# EAGLE design marty (EAGLE 6.4)

## Sheet 1 of 3: Logic
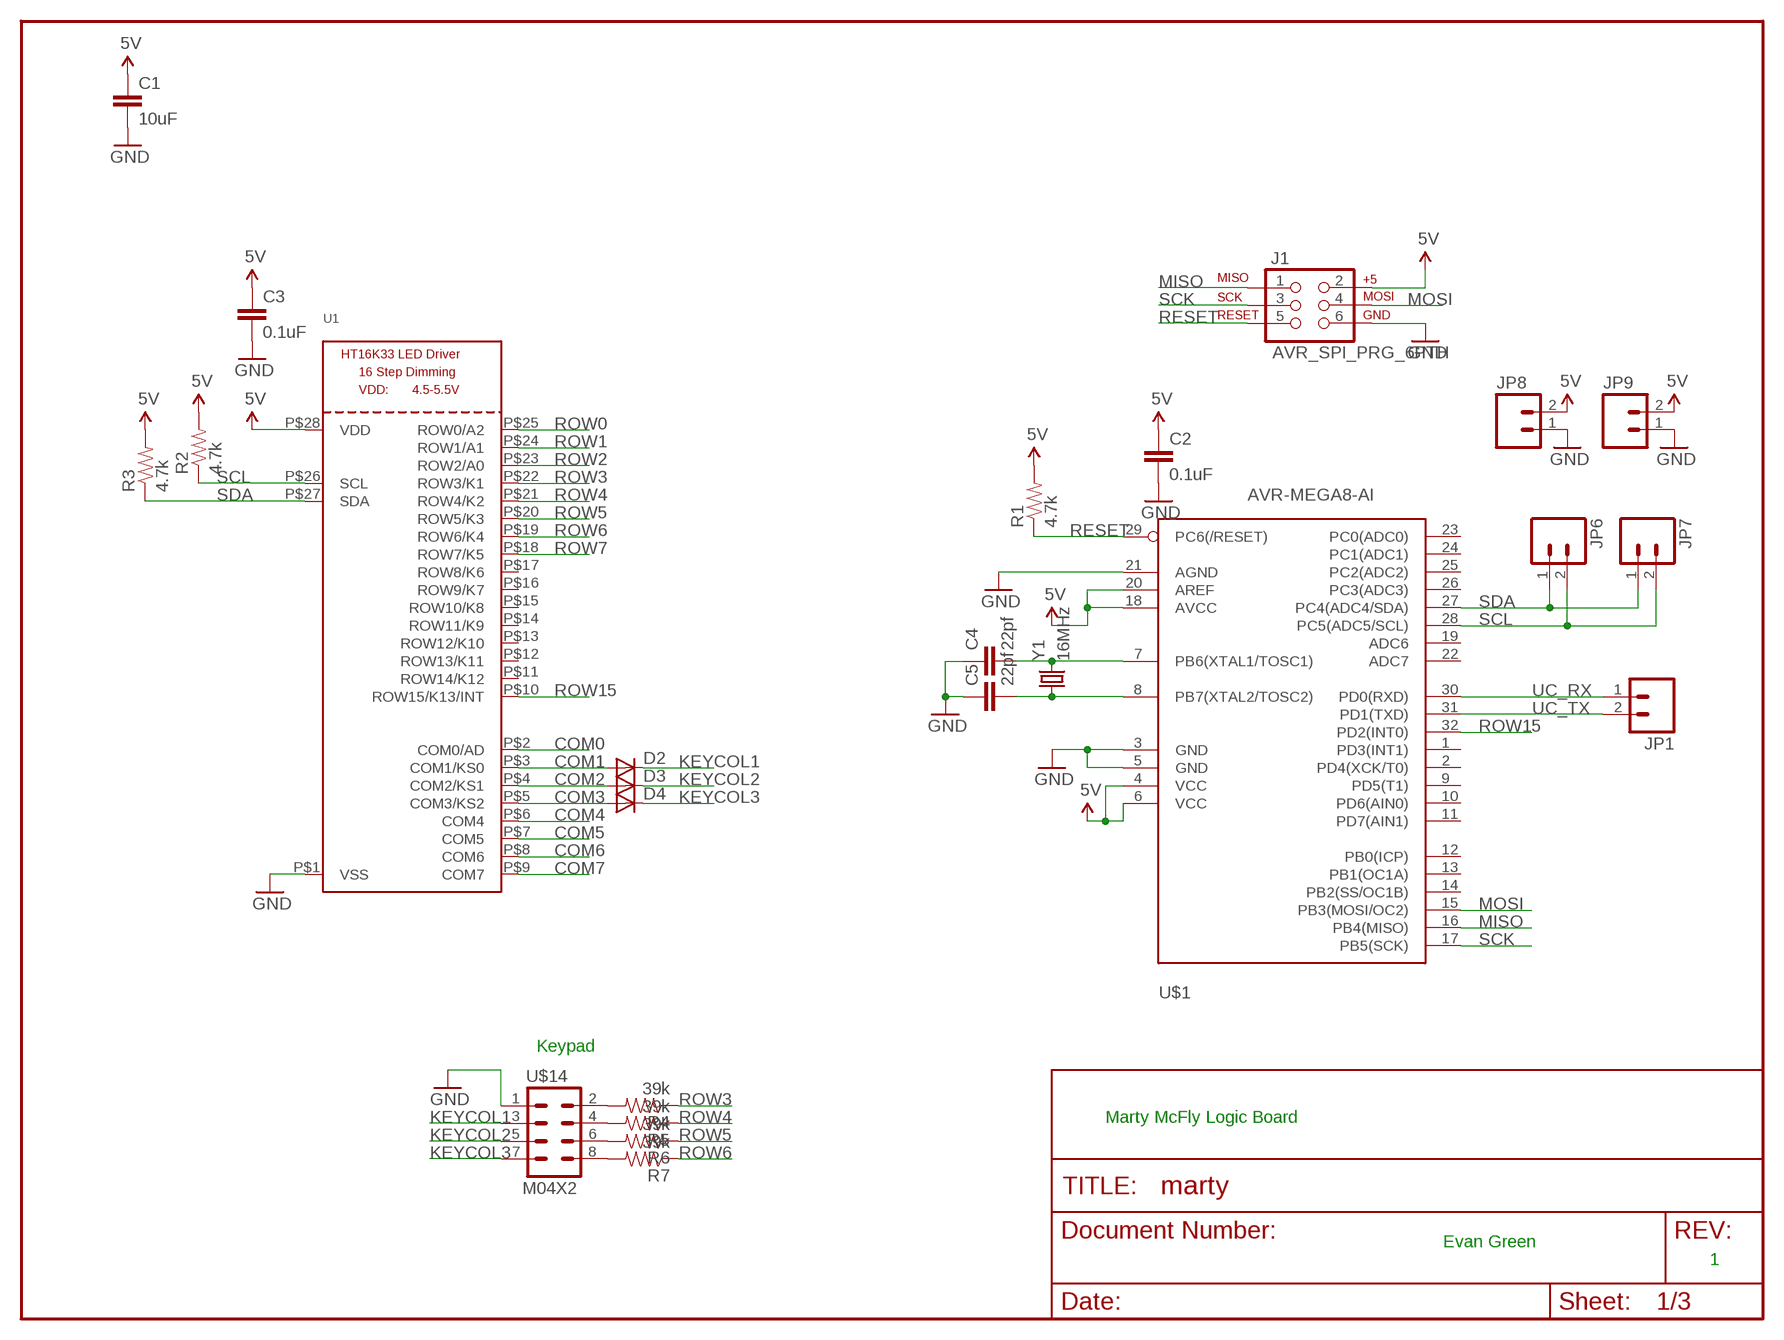
[diagram p0: schematic, sheet 1]

### Parts
C1  10uF  CAP1210  [1210]
C2  0.1uF  CAP0402-CAP  [0402-CAP]
C3  0.1uF  CAP0402-CAP  [0402-CAP]
C4  22pf  CAP0402-CAP  [0402-CAP]
C5  22pf  CAP0402-CAP  [0402-CAP]
D2  DIODESOD  [SOD-323]
D3  DIODESOD  [SOD-323]
D4  DIODESOD  [SOD-323]
J1  AVR_SPI_PRG_6PTH  [2X3]
JP1  M02PTH  [1X02]
JP6  M02PTH  [1X02]
JP7  M02PTH  [1X02]
JP8  M02PTH  [1X02]
JP9  M02PTH  [1X02]
R1  4.7k  RESISTOR0402-RES  [0402-RES]
R2  4.7k  RESISTOR0402-RES  [0402-RES]
R3  4.7k  RESISTOR0402-RES  [0402-RES]
R4  39k  RESISTOR0402-RES  [0402-RES]
R5  39k  RESISTOR0402-RES  [0402-RES]
R6  39k  RESISTOR0402-RES  [0402-RES]
R7  39k  RESISTOR0402-RES  [0402-RES]
U1  HT16K33_SOP28  [SOP28_300MIL]
U$1  AVR-MEGA8-AI  [TQFP32-08]
U$14  M04X2  [2X4]
Y1  16MHz  CRYSTALHC49US  [HC49US]

### Nets
5V: C1.1 C2.1 C3.1 J1.2 JP8.2 JP9.2 R1.2 R2.2 R3.2 U1.P$28(VDD) U$1.4(VCC) U$1.6(VCC) U$1.18(AVCC) U$1.20(AREF)
COM0: U1.P$2(COM0/AD) ; also sheet 3
COM1: D2.2(A) U1.P$3(COM1/KS0) ; also sheet 3
COM2: D3.2(A) U1.P$4(COM2/KS1) ; also sheet 3
COM3: D4.2(A) U1.P$5(COM3/KS2) ; also sheet 3
COM4: U1.P$6(COM4) ; also sheet 3
COM5: U1.P$7(COM5) ; also sheet 3
COM6: U1.P$8(COM6) ; also sheet 3
COM7: U1.P$9(COM7) ; also sheet 3
GND: C1.2 C2.2 C3.2 C4.1 C5.1 J1.6 JP8.1 JP9.1 U1.P$1(VSS) U$1.3(GND) U$1.5(GND) U$1.21(AGND) U$14.1
KEYCOL1: D2.1(C) U$14.3
KEYCOL2: D3.1(C) U$14.5
KEYCOL3: D4.1(C) U$14.7
MISO: J1.1 U$1.16(PB4(MISO))
MOSI: J1.4 U$1.15(PB3(MOSI/OC2))
N$1: C4.2 U$1.7(PB6(XTAL1/TOSC1)) Y1.2
N$2: C5.2 U$1.8(PB7(XTAL2/TOSC2)) Y1.1
N$3: R4.2 U$14.2
N$4: R5.2 U$14.4
N$5: R6.2 U$14.6
N$6: R7.2 U$14.8
RESET: J1.5 R1.1 U$1.29(PC6(/RESET))
ROW0: U1.P$25(ROW0/A2) ; also sheet 3
ROW1: U1.P$24(ROW1/A1) ; also sheet 3
ROW2: U1.P$23(ROW2/A0) ; also sheet 3
ROW3: R4.1 U1.P$22(ROW3/K1) ; also sheet 3
ROW4: R5.1 U1.P$21(ROW4/K2) ; also sheet 3
ROW5: R6.1 U1.P$20(ROW5/K3) ; also sheet 3
ROW6: R7.1 U1.P$19(ROW6/K4) ; also sheet 3
ROW7: U1.P$18(ROW7/K5) ; also sheet 3
ROW15: U1.P$10(ROW15/K13/INT) U$1.32(PD2(INT0))
SCK: J1.3 U$1.17(PB5(SCK))
SCL: JP6.2 JP7.2 R2.1 U1.P$26(SCL) U$1.28(PC5(ADC5/SCL))
SDA: JP6.1 JP7.1 R3.1 U1.P$27(SDA) U$1.27(PC4(ADC4/SDA))
UC_RX: JP1.1 U$1.30(PD0(RXD))
UC_TX: JP1.2 U$1.31(PD1(TXD))
Unconnected: U1.P$11(ROW14/K12) U1.P$12(ROW13/K11) U1.P$13(ROW12/K10) U1.P$14(ROW11/K9) U1.P$15(ROW10/K8) U1.P$16(ROW9/K7) U1.P$17(ROW8/K6) U$1.1(PD3(INT1)) U$1.2(PD4(XCK/T0)) U$1.9(PD5(T1)) U$1.10(PD6(AIN0)) U$1.11(PD7(AIN1)) U$1.12(PB0(ICP)) U$1.13(PB1(OC1A)) U$1.14(PB2(SS/OC1B)) U$1.19(ADC6) U$1.22(ADC7) U$1.23(PC0(ADC0)) U$1.24(PC1(ADC1)) U$1.25(PC2(ADC2)) U$1.26(PC3(ADC3))

### Notes on the sheet
- Keypad
- Marty McFly Logic Board
- Evan Green
- 1

## Sheet 2 of 3: LEDs
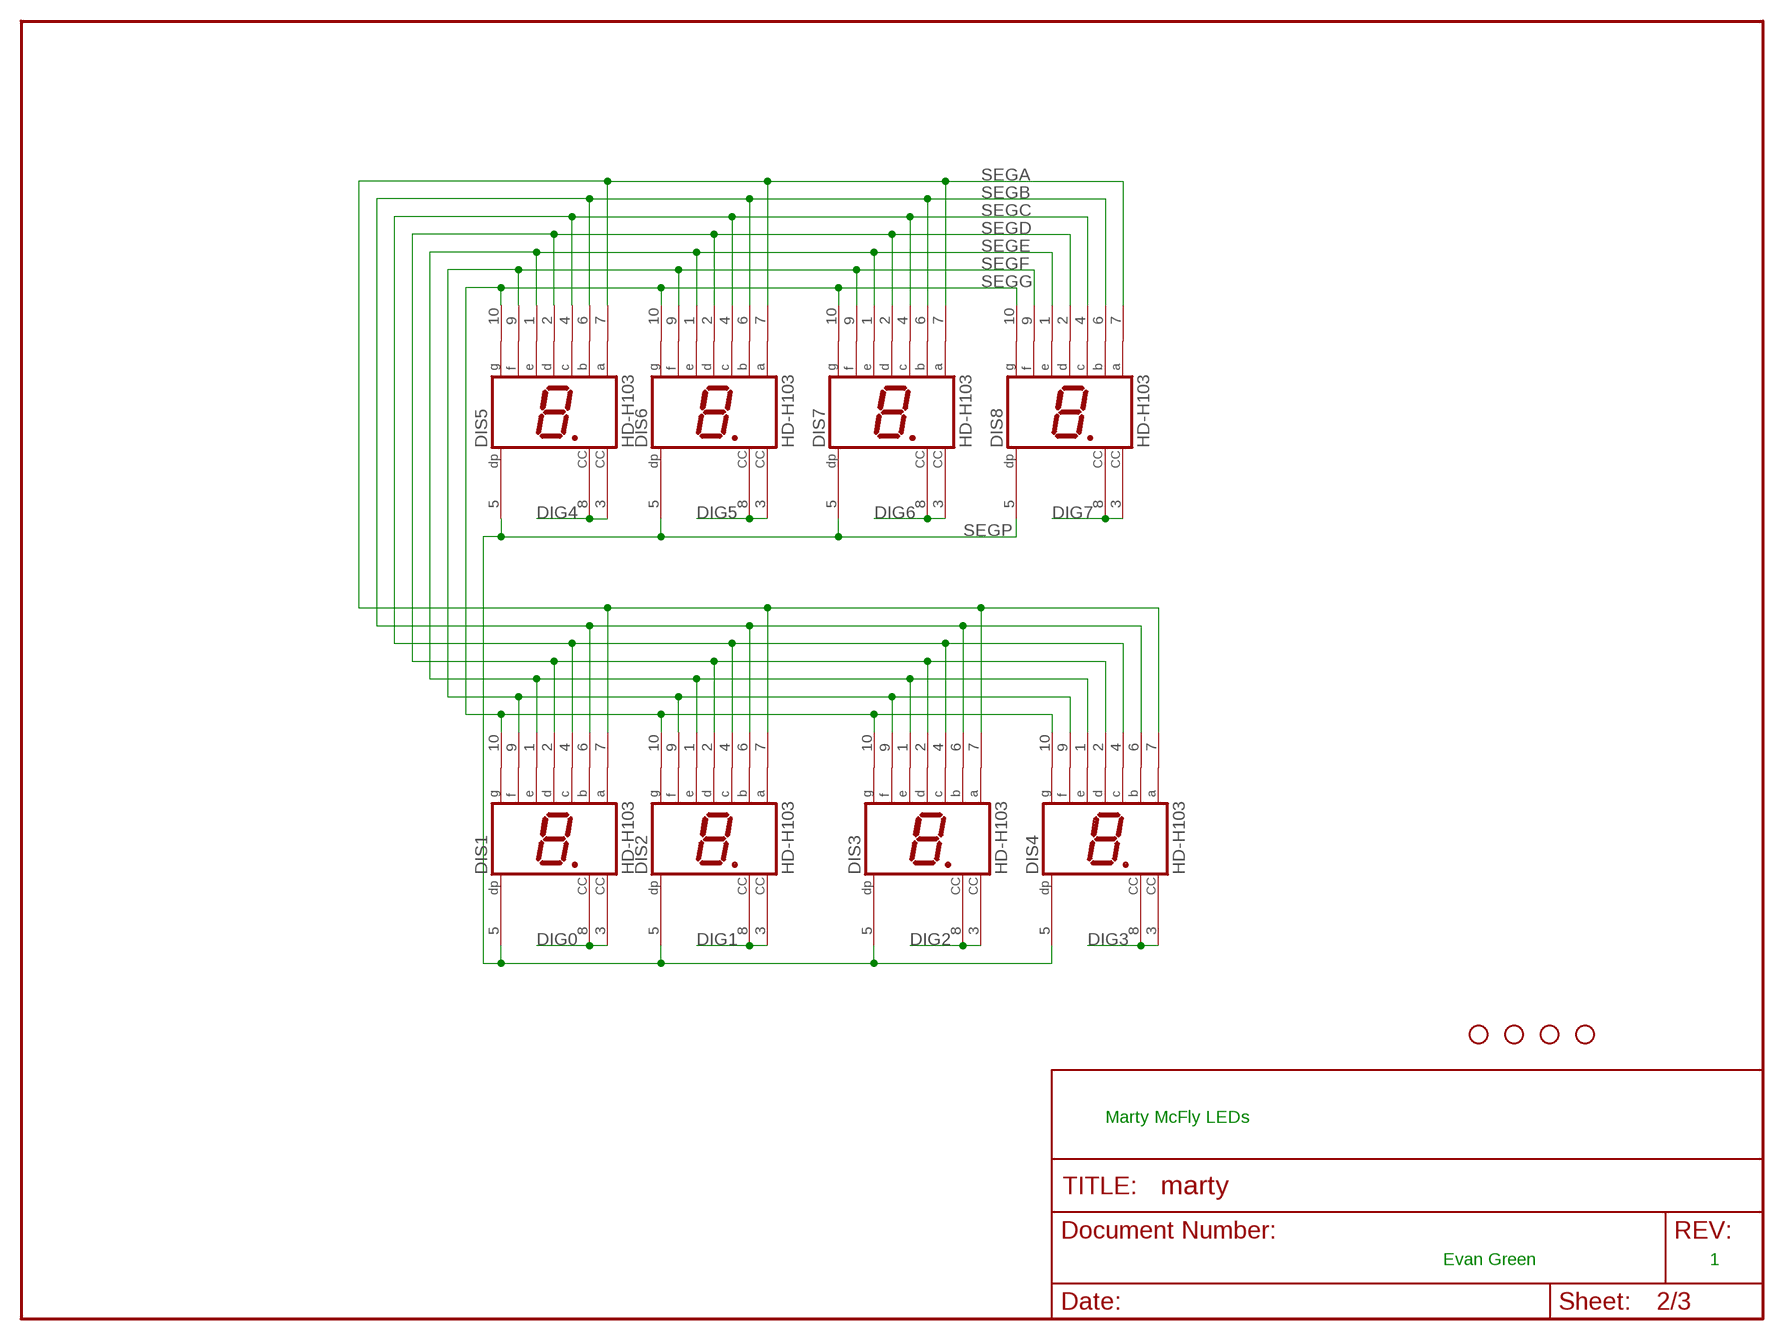
[diagram p1: schematic, sheet 2]

### Parts
DIS1  HD-H103  [HDSP-M]
DIS2  HD-H103  [HDSP-M]
DIS3  HD-H103  [HDSP-M]
DIS4  HD-H103  [HDSP-M]
DIS5  HD-H103  [HDSP-M]
DIS6  HD-H103  [HDSP-M]
DIS7  HD-H103  [HDSP-M]
DIS8  HD-H103  [HDSP-M]
JP2  STAND-OFF  [STAND-OFF]
JP3  STAND-OFF  [STAND-OFF]
JP4  STAND-OFF  [STAND-OFF]
JP5  STAND-OFF  [STAND-OFF]

### Nets
DIG0: DIS1.3(CC) DIS1.8(CC) ; also sheet 3
DIG1: DIS2.3(CC) DIS2.8(CC) ; also sheet 3
DIG2: DIS3.3(CC) DIS3.8(CC) ; also sheet 3
DIG3: DIS4.3(CC) DIS4.8(CC) ; also sheet 3
DIG4: DIS5.3(CC) DIS5.8(CC) ; also sheet 3
DIG5: DIS6.3(CC) DIS6.8(CC) ; also sheet 3
DIG6: DIS7.3(CC) DIS7.8(CC) ; also sheet 3
DIG7: DIS8.3(CC) DIS8.8(CC) ; also sheet 3
SEGA: DIS1.7(A) DIS2.7(A) DIS3.7(A) DIS4.7(A) DIS5.7(A) DIS6.7(A) DIS7.7(A) DIS8.7(A) ; also sheet 3
SEGB: DIS1.6(B) DIS2.6(B) DIS3.6(B) DIS4.6(B) DIS5.6(B) DIS6.6(B) DIS7.6(B) DIS8.6(B) ; also sheet 3
SEGC: DIS1.4(C) DIS2.4(C) DIS3.4(C) DIS4.4(C) DIS5.4(C) DIS6.4(C) DIS7.4(C) DIS8.4(C) ; also sheet 3
SEGD: DIS1.2(D) DIS2.2(D) DIS3.2(D) DIS4.2(D) DIS5.2(D) DIS6.2(D) DIS7.2(D) DIS8.2(D) ; also sheet 3
SEGE: DIS1.1(E) DIS2.1(E) DIS3.1(E) DIS4.1(E) DIS5.1(E) DIS6.1(E) DIS7.1(E) DIS8.1(E) ; also sheet 3
SEGF: DIS1.9(F) DIS2.9(F) DIS3.9(F) DIS4.9(F) DIS5.9(F) DIS6.9(F) DIS7.9(F) DIS8.9(F) ; also sheet 3
SEGG: DIS1.10(G) DIS2.10(G) DIS3.10(G) DIS4.10(G) DIS5.10(G) DIS6.10(G) DIS7.10(G) DIS8.10(G) ; also sheet 3
SEGP: DIS1.5(DP) DIS2.5(DP) DIS3.5(DP) DIS4.5(DP) DIS5.5(DP) DIS6.5(DP) DIS7.5(DP) DIS8.5(DP) ; also sheet 3

### Notes on the sheet
- Marty McFly LEDs
- Evan Green | 1

## Sheet 3 of 3: Mux
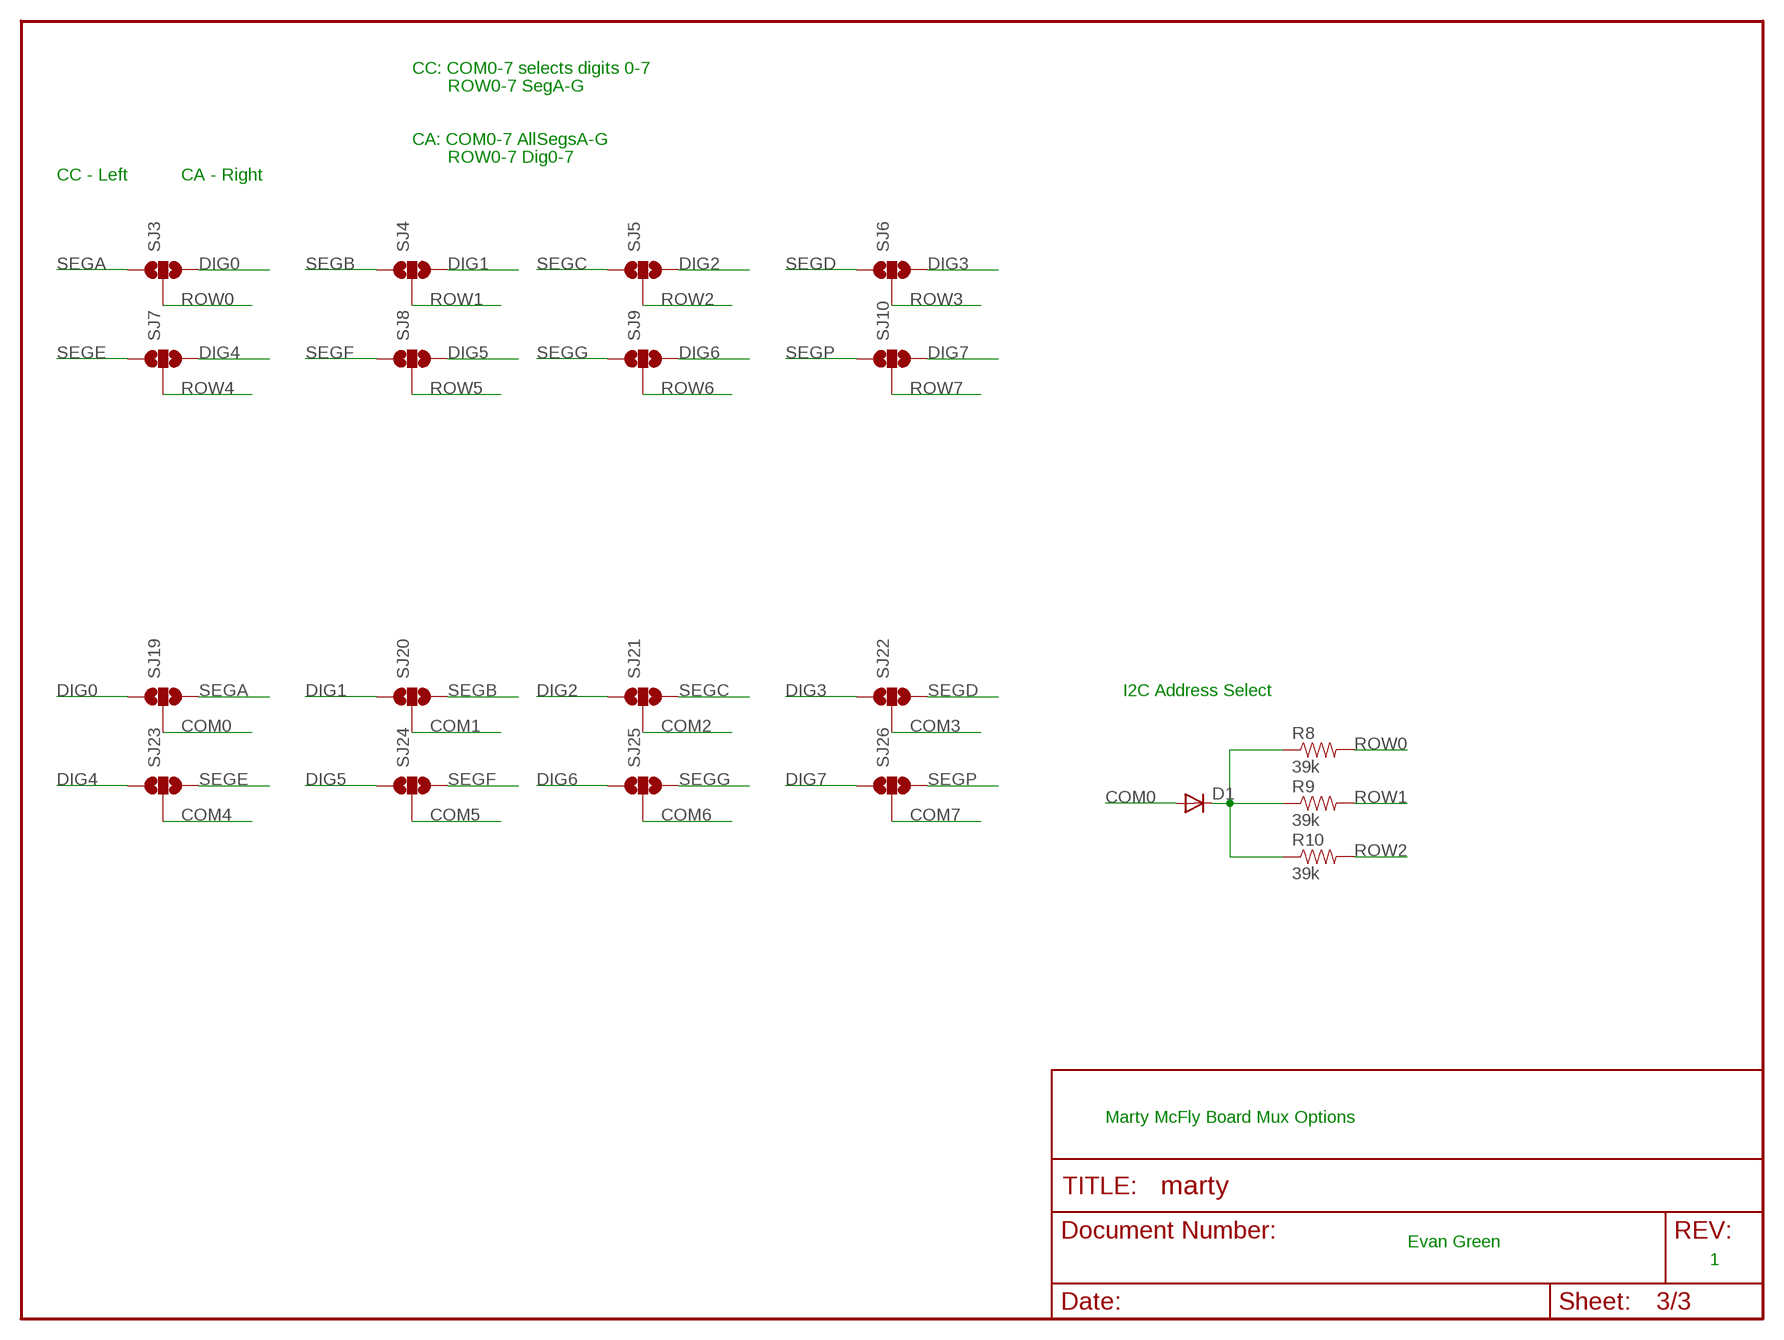
[diagram p2: schematic, sheet 3]

### Parts
D1  DIODESOD  [SOD-323]
R8  39k  RESISTOR0402-RES  [0402-RES]
R9  39k  RESISTOR0402-RES  [0402-RES]
R10  39k  RESISTOR0402-RES  [0402-RES]
SJ3  SOLDERJUMPER_2WAYS  [SJ_3]
SJ4  SOLDERJUMPER_2WAYS  [SJ_3]
SJ5  SOLDERJUMPER_2WAYS  [SJ_3]
SJ6  SOLDERJUMPER_2WAYS  [SJ_3]
SJ7  SOLDERJUMPER_2WAYS  [SJ_3]
SJ8  SOLDERJUMPER_2WAYS  [SJ_3]
SJ9  SOLDERJUMPER_2WAYS  [SJ_3]
SJ10  SOLDERJUMPER_2WAYS  [SJ_3]
SJ19  SOLDERJUMPER_2WAYS  [SJ_3]
SJ20  SOLDERJUMPER_2WAYS  [SJ_3]
SJ21  SOLDERJUMPER_2WAYS  [SJ_3]
SJ22  SOLDERJUMPER_2WAYS  [SJ_3]
SJ23  SOLDERJUMPER_2WAYS  [SJ_3]
SJ24  SOLDERJUMPER_2WAYS  [SJ_3]
SJ25  SOLDERJUMPER_2WAYS  [SJ_3]
SJ26  SOLDERJUMPER_2WAYS  [SJ_3]

### Nets
COM0: D1.2(A) SJ19.2 ; also sheet 1
COM1: SJ20.2 ; also sheet 1
COM2: SJ21.2 ; also sheet 1
COM3: SJ22.2 ; also sheet 1
COM4: SJ23.2 ; also sheet 1
COM5: SJ24.2 ; also sheet 1
COM6: SJ25.2 ; also sheet 1
COM7: SJ26.2 ; also sheet 1
DIG0: SJ3.3 SJ19.1 ; also sheet 2
DIG1: SJ4.3 SJ20.1 ; also sheet 2
DIG2: SJ5.3 SJ21.1 ; also sheet 2
DIG3: SJ6.3 SJ22.1 ; also sheet 2
DIG4: SJ7.3 SJ23.1 ; also sheet 2
DIG5: SJ8.3 SJ24.1 ; also sheet 2
DIG6: SJ9.3 SJ25.1 ; also sheet 2
DIG7: SJ10.3 SJ26.1 ; also sheet 2
N$8: D1.1(C) R8.1 R9.1 R10.1
ROW0: R8.2 SJ3.2 ; also sheet 1
ROW1: R9.2 SJ4.2 ; also sheet 1
ROW2: R10.2 SJ5.2 ; also sheet 1
ROW3: SJ6.2 ; also sheet 1
ROW4: SJ7.2 ; also sheet 1
ROW5: SJ8.2 ; also sheet 1
ROW6: SJ9.2 ; also sheet 1
ROW7: SJ10.2 ; also sheet 1
SEGA: SJ3.1 SJ19.3 ; also sheet 2
SEGB: SJ4.1 SJ20.3 ; also sheet 2
SEGC: SJ5.1 SJ21.3 ; also sheet 2
SEGD: SJ6.1 SJ22.3 ; also sheet 2
SEGE: SJ7.1 SJ23.3 ; also sheet 2
SEGF: SJ8.1 SJ24.3 ; also sheet 2
SEGG: SJ9.1 SJ25.3 ; also sheet 2
SEGP: SJ10.1 SJ26.3 ; also sheet 2

### Notes on the sheet
- CC: COM0-7 selects digits 0-7
- ROW0-7 SegA-G
- CA: COM0-7 AllSegsA-G
- ROW0-7 Dig0-7
- CC - Left | CA - Right
- I2C Address Select
- Marty McFly Board Mux Options
- Evan Green
- 1

## Library data of the parts
C1-C5 = SparkFun:CAP: Capacitor Standard 0603 ceramic capacitor, and 0.1" leaded capacitor.
D1-D4 = SparkFun:DIODE: Diode These are standard reverse protection diodes and small signal diodes. SMA package can handle up to about 1A. SOD-323 can handle about 200mA. What the SOD-323 package when ordering, there are some mfgs out there that are 5-pin packages.
DIS1-DIS8 = display-hp:HD-H103: LED DISPLAY 1-character 7 segment, decimal point right
J1 = SparkFun:AVR_SPI_PRG_6: AVR ISP 6 Pin This is the reduced ISP connector for AVR programming. Common on Arduino. This footprint will take up less PCB space and can be used with a 10-pin to 6-pin adapter such as SKU: BOB-08508
JP1 JP6-JP9 = SparkFun:M02: Header 2 Standard 2-pin 0.1" header. Use with straight break away headers (SKU : PRT-00116), right angle break away headers (PRT-00553), swiss pins (PRT-00743), machine pins (PRT-00117), and female headers (PRT-00115). Molex polarized connector foot print use with SKU : PRT-08233 with associated crimp pins and housings.
JP2-JP5 = SparkFun:STAND-OFF: Stand Off This is the mechanical footprint for a #4 phillips button head screw. Use the keepout ring to avoid running the screw head into surrounding components. SKU : PRT-00447
R1-R10 = SparkFun:RESISTOR: Resistor Basic schematic elements and footprints for 0603, 1206, and PTH resistors.
SJ3-SJ10 SJ19-SJ26 = SparkFun:SOLDERJUMPER_2WAY: Solder Jumper 2 way solder jumper
U1 = microbuilder:HT16K33_SOP28
U$1 = SparkFun:AVR-MEGA8: MICROCONTROLLER 8 Kbytes FLASH 1 kbytes SRAM 512 bytes EEPROM USART 6-channel 10 bit ADC 2-channel 8 bit ADC
U$14 = SparkFun:M04X2
Y1 = SparkFun:CRYSTAL: Crystals Various standard crystals. Proven footprints. Spark Fun Electronics SKU : COM-00534

## Board
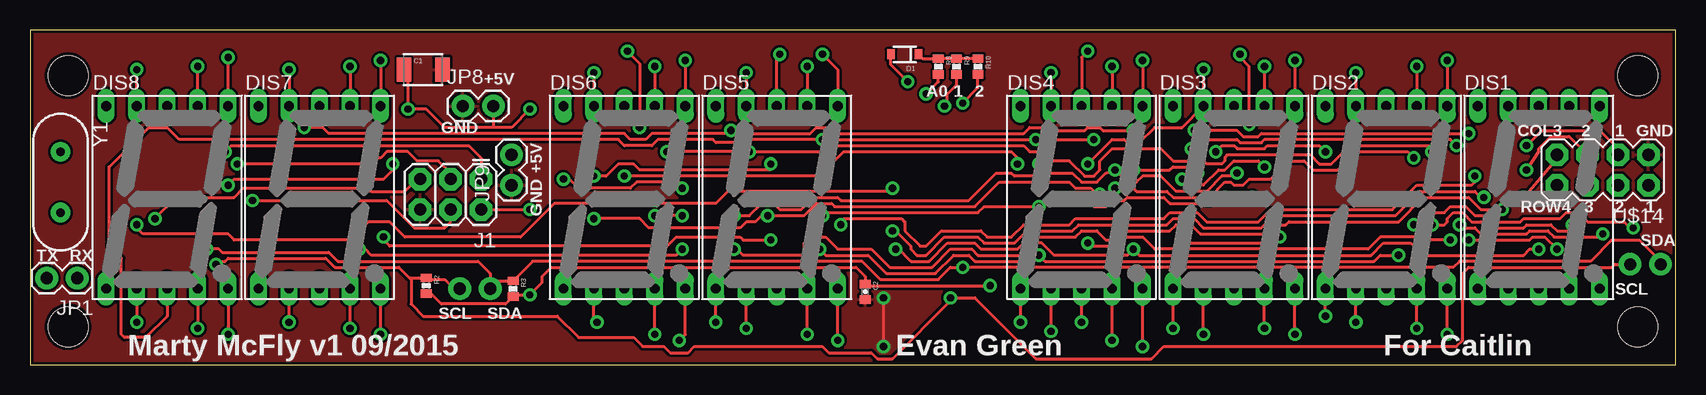
[diagram p3: board, top side]
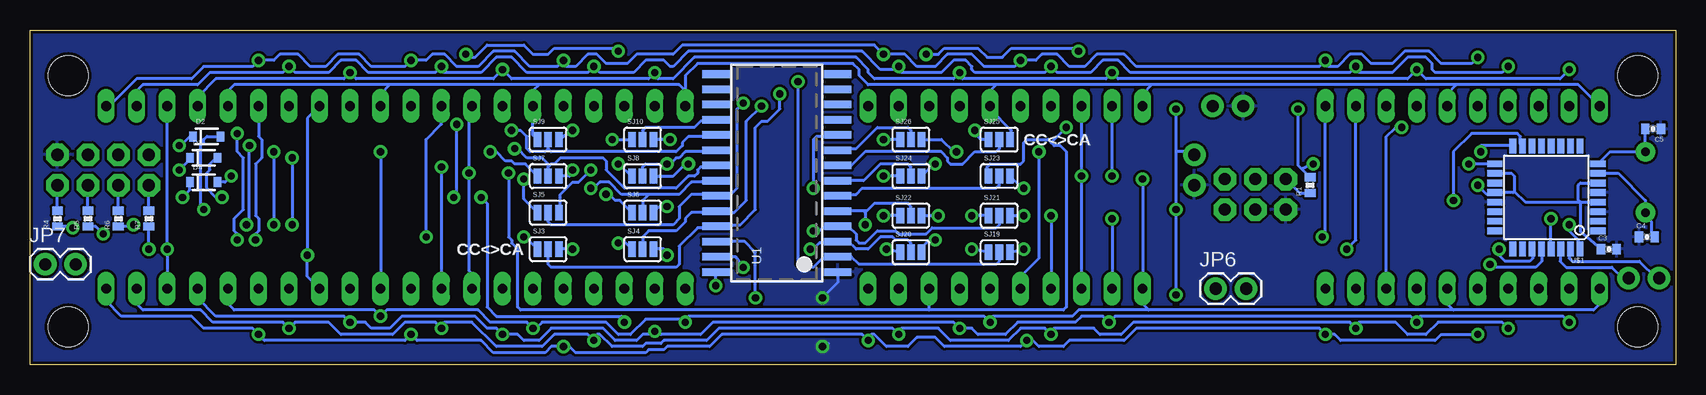
[diagram p4: board, bottom side, seen from below]

Size 137.16 x 27.94 mm. Coordinates in mm from the lower left corner, seen from the top.
Outline: 0,0 137.16,0 137.16,27.94 0,27.94 0,0
Copper layers (1*16): Top 0.035mm / dielectric 1.5mm / Bottom 0.035mm
Design rules "SparkFun": minimum track width 8mil, minimum drill 20mil, track to track 8mil, track to pad 8mil, pad to pad 8mil, via to via 8mil, smd to smd 8mil, copper to edge 10mil, drill to drill 8mil, minimum pad ring 12mil, minimum via ring 10mil, stop-mask expansion 4mil, vias tented up to drill 25mil, thermal gap 10mil

### Footprints (pad centres in the part's own frame; a part is rotated, then mirrored left to right if it is on the bottom)
1210 = smd 1.2 x 2: 1 -1.6,0; 2 1.6,0
0402-CAP = smd 0.7 x 0.9: 1 -0.65,0; 2 0.65,0
SOD-323 = smd 0.63 x 0.83: 1 -1.15,0; 2 1.15,0
HDSP-M = drill 0.813 long: 1 -5.08,-7.62; 2 -2.54,-7.62; 3 0,-7.62; 4 2.54,-7.62; 5 5.08,-7.62; 6 5.08,7.62; 7 2.54,7.62; 8 0,7.62; 9 -2.54,7.62; 10 -5.08,7.62
2X3 = drill 1.016 pad 1.88 octagon: 1 0,0; 2 0,2.54; 3 2.54,0; 4 2.54,2.54; 5 5.08,0; 6 5.08,2.54
1X02 = drill 1.016 pad 1.88: 1 0,0; 2 2.54,0
STAND-OFF = hole 3.302: 0,0
0402-RES = smd 0.7 x 0.9: 1 -0.65,0; 2 0.65,0
SJ_3 = smd 0.635 x 1.27: 1 -0.889,0; 2 0,0; 3 0.889,0
SOP28_300MIL = smd 0.635 x 2.286: P$1 -8.255,-5.08; P$2 -6.985,-5.08; P$3 -5.715,-5.08; P$4 -4.445,-5.08; P$5 -3.175,-5.08; P$6 -1.905,-5.08; P$7 -0.635,-5.08; P$8 0.635,-5.08; P$9 1.905,-5.08; P$10 3.175,-5.08; P$11 4.445,-5.08; P$12 5.715,-5.08; P$13 6.985,-5.08; P$14 8.255,-5.08; P$15 8.255,5.08; P$16 6.985,5.08; P$17 5.715,5.08; P$18 4.445,5.08; P$19 3.175,5.08; P$20 1.905,5.08; P$21 0.635,5.08; P$22 -0.635,5.08; P$23 -1.905,5.08; P$24 -3.175,5.08; P$25 -4.445,5.08; P$26 -5.715,5.08; P$27 -6.985,5.08; P$28 -8.255,5.08
TQFP32-08 = smd 1.27 x 0.559: 1 -4.293,2.8; 2 -4.293,2; 3 -4.293,1.2; 4 -4.293,0.4; 5 -4.293,-0.4; 6 -4.293,-1.2; 7 -4.293,-2; 8 -4.293,-2.8; 17 4.293,-2.8; 18 4.293,-2; 19 4.293,-1.2; 20 4.293,-0.4; 21 4.293,0.4; 22 4.293,1.2; 23 4.293,2; 24 4.293,2.8 | smd 0.559 x 1.27: 9 -2.8,-4.293; 10 -2,-4.293; 11 -1.2,-4.293; 12 -0.4,-4.293; 13 0.4,-4.293; 14 1.2,-4.293; 15 2,-4.293; 16 2.8,-4.293; 25 2.8,4.293; 26 2,4.293; 27 1.2,4.293; 28 0.4,4.293; 29 -0.4,4.293; 30 -1.2,4.293; 31 -2,4.293; 32 -2.8,4.293
2X4 = drill 1.016 pad 1.88 octagon: 1 -3.81,-1.27; 2 -3.81,1.27; 3 -1.27,-1.27; 4 -1.27,1.27; 5 1.27,-1.27; 6 1.27,1.27; 7 3.81,-1.27; 8 3.81,1.27
HC49US = drill 0.7 pad 1.651: 1 -2.54,0; 2 2.54,0

### Placement (x,y rotation side)
C1  32.77,24.64 0 top
C2  69.6,6.1 270 top
C3  5.59,9.65 0 bottom
C4  2.41,10.67 0 bottom
C5  1.91,19.68 180 bottom
D1  72.9,25.91 180 top
D2  122.43,19.05 0 bottom
D3  122.68,17.27 0 bottom
D4  122.68,15.24 0 bottom
DIS1  125.73,13.97 0 top
DIS2  113.03,13.97 0 top
DIS3  100.33,13.97 0 top
DIS4  87.63,13.97 0 top
DIS5  62.23,13.97 0 top
DIS6  49.53,13.97 0 top
DIS7  24.13,13.97 0 top
DIS8  11.43,13.97 0 top
J1  37.59,15.49 180 top
JP1  3.94,7.24 180 top
JP2  3.17,24.13 0 top
JP3  3.17,3.17 0 top
JP4  133.99,3.17 0 top
JP5  133.99,24.13 0 top
JP6  38.35,6.35 0 bottom
JP7  135.89,8.38 0 bottom
JP8  36.07,21.59 0 top
JP9  40.13,14.99 90 top
R1  30.48,14.99 90 bottom
R2  33.02,6.6 270 top
R3  40.26,6.35 270 top
R4  134.87,12.19 90 bottom
R5  132.33,12.19 90 bottom
R6  129.79,12.19 90 bottom
R7  127.25,12.19 90 bottom
R8  75.69,24.89 270 top
R9  77.22,24.89 270 top
R10  78.99,24.89 270 top
SJ3  93.98,9.65 0 bottom
SJ4  86.11,9.65 0 bottom
SJ5  93.98,12.7 0 bottom
SJ6  86.11,12.7 0 bottom
SJ7  93.98,15.75 0 bottom
SJ8  86.11,15.75 0 bottom
SJ9  93.98,18.8 0 bottom
SJ10  86.11,18.8 0 bottom
SJ19  56.39,9.4 0 bottom
SJ20  63.75,9.4 0 bottom
SJ21  56.39,12.45 0 bottom
SJ22  63.75,12.45 0 bottom
SJ23  56.39,15.75 0 bottom
SJ24  63.75,15.75 0 bottom
SJ25  56.39,18.8 0 bottom
SJ26  63.75,18.8 0 bottom
U1  74.93,16 90 bottom
U$1  10.79,13.97 180 bottom
U$14  131.06,16.26 180 top
Y1  2.54,15.24 270 top

### Tracks (layer width: path | path; a pad name or v marks a point on that pad's centre or on a via)
5V  (via drill 0.6)
  Top 0.254: v16.51,14.99 17.02,15.49 29.46,15.49 30.48,16.51 v30.23,16.76 | R2.2 33.42,5.95 34.29,5.08 39.64,5.08 R3.2 40.4,5.84 v41.66,5.84 42.67,6.86 42.67,7.37 43.43,8.13 68.83,8.13 69.6,7.37 C2.1 69.74,6.6 v80.01,6.6 | v41.66,21.34 40.13,19.81 38.61,19.81 | 38.61,19.81 34.54,19.81 33.02,21.34 v31.5,21.34 31.5,24.31 C1.1 | J1.2 v41.66,12.95 | JP8.2 38.61,19.81
  Bottom 0.254: U$1.18 15.06,16 13.72,16 13.46,15.75 13.46,14.48 | 13.46,14.48 13.57,14.37 U$1.20 15.23,14.22 15.75,14.22 v16.51,14.99 | 13.46,14.48 12.55,13.57 7.95,13.57 | 7.95,13.57 U$1.4 | 7.95,13.57 8.13,13.75 8.13,14.99 7.94,15.17 U$1.6 | C3.1 7.95,11.11 7.95,13.57 | v31.5,21.34 31.5,16.65 31.17,16.33 | v41.66,5.84 v41.66,12.95 41.66,17.78 | 41.66,17.78 v41.66,21.34 | v80.01,6.6 U1.P$28 | R1.2 31.17,16.33 | v30.23,16.76 31.17,16.33 | JP9.2 40.39,17.78 41.66,17.78
COM0  (via drill 0.6)
  Top 0.254: v73.15,23.62 71.75,25.03 D1.2
  Bottom 0.254: SJ19.2 56.39,8.64 56.64,8.38 68.07,8.38 68.71,9.02 U1.P$2 69.98,8.89 71.12,8.89 71.88,8.13 72.9,8.13 73.15,8.38 v73.15,23.62
COM1  (via drill 0.6)
  Top 0.254: v122.68,12.95 120.9,12.95 119.89,13.97 116.08,13.97 114.05,11.94 104.9,11.94 104.65,11.68 103.63,11.68 102.87,10.92 97.54,10.92 96.77,11.68 95.5,11.68 95,11.18 90.93,11.18 90.17,10.41 89.66,10.41 88.9,11.18 87.63,11.18 87.12,10.67 83.31,10.67 82.3,9.65 79.25,9.65 78.74,10.16 76.45,10.16 74.93,8.64 73.41,8.64 72.39,9.65 v72.14,9.65
  Bottom 0.254: SJ20.2 63.75,10.16 64.01,10.41 65.02,10.41 65.28,10.67 66.29,10.67 67.31,9.65 68.33,9.65 68.96,10.29 U1.P$3 69.98,10.16 71.37,10.16 71.88,9.65 v72.14,9.65 | D2.2 122.43,19.05 122.68,18.8 122.68,18.54 122.94,18.29 122.94,13.21 v122.68,12.95
COM2  (via drill 0.6)
  Top 0.254: v121.16,13.97 120.9,13.97 120.4,14.48 115.82,14.48 113.79,12.45 103.63,12.45 102.62,11.43 97.79,11.43 97.03,12.19 95.25,12.19 94.74,11.68 87.38,11.68 86.87,11.18 83.06,11.18 82.04,10.16 79.5,10.16 78.99,10.67 76.2,10.67 74.68,9.14 73.91,9.14 73.41,9.65 73.41,9.91 72.14,11.18 v71.88,11.18
  Bottom 0.254: SJ21.2 56.39,11.68 56.64,11.43 61.98,11.43 62.48,10.92 64.77,10.92 65.02,11.18 66.55,11.18 67.56,10.16 68.07,10.16 68.33,10.41 68.33,10.92 68.96,11.56 U1.P$4 69.98,11.43 71.12,11.43 71.37,11.18 v71.88,11.18 | v121.16,13.97 121.67,13.97 122.43,14.73 122.43,16 122.17,16.26 122.17,16.76 121.67,17.27 D3.2
COM3  (via drill 0.6)
  Top 0.254: v67.56,11.68 67.82,12.19 72.64,12.19 72.9,11.94 72.9,11.18 74.17,9.91 74.68,9.91 75.95,11.18 79.25,11.18 79.76,10.67 81.79,10.67 82.8,11.68 86.61,11.68 87.12,12.19 94.49,12.19 95,12.7 97.28,12.7 98.04,11.94 102.36,11.94 103.38,12.95 113.54,12.95 115.57,14.99 120.14,14.99 120.4,15.24 v120.4,15.75
  Bottom 0.254: SJ22.2 63.75,13.21 64.01,13.46 66.8,13.46 67.44,12.83 | 67.44,12.83 U1.P$5 | 67.44,12.83 67.56,12.7 v67.56,11.68 | v120.4,15.75 120.9,15.24 D4.2
COM4
  Bottom 0.254: U1.P$6 69.72,14.22 68.33,14.22 67.82,14.73 56.64,14.73 56.39,14.99 SJ23.2
COM5
  Bottom 0.254: SJ24.2 63.75,16.51 64.01,16.76 66.29,16.76 67.69,15.37 U1.P$7
COM6
  Bottom 0.254: SJ25.2 56.39,18.03 56.64,17.78 58.42,17.78 59.44,16.76 60.45,16.76 60.71,17.02 60.71,17.27 61.21,17.78 67.56,17.78 68.71,16.64 U1.P$8
COM7
  Bottom 0.254: U1.P$9 69.72,18.03 68.33,18.03 66.55,19.81 64.01,19.81 63.75,19.56 SJ26.2
DIG0  (via drill 0.6)
  Top 0.254: v58.67,9.65 58.93,9.65 59.44,9.14 64.26,9.14 64.52,9.4 64.52,10.16 65.02,10.67 66.29,10.67 67.31,9.65 70.1,9.65 71.63,8.13 75.18,8.13 76.71,9.65 78.49,9.65 78.99,9.14 82.55,9.14 83.57,10.16 84.33,10.16 85.34,9.14 91.44,9.14 v91.95,9.65 92.46,9.14 111.76,9.14 112.78,10.16 115.06,10.16 116.08,9.14 124.46,9.14 124.97,9.65 v125.73,9.65
  Bottom 0.254: SJ19.1 v58.67,9.65 | v91.95,9.65 SJ3.3 | DIS1.3 v125.73,9.65 DIS1.8
DIG1  (via drill 0.6)
  Top 0.254: v114.05,9.14 112.52,9.14 112.01,8.64 84.58,8.64 v84.07,9.14 83.31,9.14 82.8,8.64 78.74,8.64 78.23,9.14 76.96,9.14 75.44,7.62 71.37,7.62 69.85,9.14 66.29,9.14 v65.79,9.65
  Bottom 0.254: SJ20.1 v65.79,9.65 | v84.07,9.14 84.33,9.65 SJ4.3 | 113.03,5.84 DIS2.3 114.05,7.37 v114.05,9.14 114.05,20.57 DIS2.8
DIG2  (via drill 0.6)
  Top 0.254: v58.67,12.45 59.94,12.45 60.96,13.46 61.98,13.46 62.48,12.95 64.26,12.95 65.28,13.97 67.31,13.97 67.56,13.72 78.23,13.72 80.52,16 81.79,16 82.04,15.75 84.58,15.75 84.84,16 86.87,16 87.63,15.24 88.9,15.24 89.66,16 v90.42,16.26 91.44,15.24 92.2,15.24 92.71,15.75 94.23,15.75 95.5,14.48 98.04,14.48 99.31,15.75 100.33,15.75 v100.58,16
  Bottom 0.254: SJ21.1 v58.67,12.45 | DIS3.8 100.58,21.34 v100.58,16 100.58,7.87 100.33,7.62 DIS3.3 | SJ5.3 92.96,12.83 92.96,14.22 91.95,15.24 91.44,15.24 v90.42,16.26
DIG3  (via drill 0.6)
  Top 0.254: v66.04,12.45 66.29,12.7 78.99,12.7 79.5,13.21 v84.07,13.21 84.84,13.97 87.88,13.97 88.65,13.21 89.66,13.21 90.17,13.72 91.19,13.72 91.44,13.97 94.49,13.97 95,13.46 98.55,13.46 99.06,13.97 v99.57,13.97 v101.85,13.97 | v87.63,3.56 DIS4.3 | v100.84,25.91 100.84,25.65 101.6,24.89 v101.6,20.07 | v88.14,26.16 87.63,25.65 DIS4.8
  Bottom 0.254: SJ22.1 v66.04,12.45 | v87.63,3.56 87.63,3.81 87.88,4.06 98.3,4.06 99.06,4.83 99.06,13.46 v99.57,13.97 | v100.84,25.91 100.58,25.65 100.08,25.65 99.06,26.67 96.01,26.67 95.25,25.91 93.98,25.91 93.47,26.42 88.39,26.42 v88.14,26.16 | SJ6.3 84.71,13.21 v84.07,13.21 | v101.85,13.97 101.6,14.22 v101.6,20.07
DIG4  (via drill 0.6)
  Top 0.254: DIS5.8 62.23,25.65 v62.48,25.91 | v49.78,26.16 50.8,25.15 v50.8,19.81 | v91.95,16.26 95,16.26 95.25,16.51 96.52,16.51 97.03,16 v97.28,16
  Bottom 0.254: SJ23.1 57.4,15.88 57.4,16.51 57.15,16.76 54.61,16.76 54.36,17.02 54.36,18.54 54.1,18.8 52.32,18.8 52.07,18.54 | 52.07,18.54 51.82,18.29 51.31,18.29 50.8,17.78 50.8,4.83 51.05,4.57 62.23,4.57 | v62.48,25.91 61.47,25.91 60.96,26.42 58.17,26.42 57.4,25.65 56.13,25.65 55.37,26.42 49.78,26.42 v49.78,26.16 | v50.8,19.81 52.07,18.54 | 62.23,4.57 DIS5.3 | 62.23,4.57 96.27,4.57 96.52,4.83 96.52,9.65 97.03,10.16 97.03,10.41 97.28,10.67 v97.28,16 | v91.95,16.26 92.2,15.75 SJ7.3
DIG5  (via drill 0.6)
  Top 0.254: v49.53,15.75 v66.04,15.75 66.04,16 67.82,17.78 81.79,17.78 82.3,17.27 v82.3,16.76
  Bottom 0.254: SJ24.1 v66.04,15.75 | DIS6.8 v49.53,15.75 DIS6.3 | SJ8.3 83.57,15.75 82.55,16.76 v82.3,16.76
DIG6  (via drill 0.6)
  Top 0.254: 24.13,19.81 DIS7.8 | 24.13,19.81 24.38,19.81 24.89,19.3 49.53,19.3 50.04,18.8 51.31,18.8 51.82,19.3 58.17,19.3 v58.42,19.56 58.67,19.3 65.02,19.3 65.53,19.81 66.55,19.81 67.06,19.3 82.8,19.3 83.31,19.81 84.58,19.81 84.84,19.56 87.88,19.56 88.14,19.81 89.15,19.81 89.41,19.56 v91.95,19.56 | 24.13,19.81 v22.86,19.81
  Bottom 0.254: SJ25.1 57.91,18.8 58.42,19.3 v58.42,19.56 | v91.95,19.56 SJ9.3 | DIS7.3 24.13,19.05 23.37,19.81 v22.86,19.81
DIG7  (via drill 0.6)
  Top 0.254: v83.82,18.8 v66.04,18.8 59.18,18.8 58.93,18.54 57.15,18.54 56.9,18.8 52.32,18.8 51.82,18.29 49.53,18.29 49.02,18.8 12.45,18.8 11.43,19.81 | 11.43,19.81 DIS8.8 | DIS8.3 11.43,4.06 9.65,2.29 7.87,2.29 7.62,2.54 7.62,8.89 6.6,9.91 6.6,16.51 9.91,19.81 11.43,19.81
  Bottom 0.254: SJ26.1 v66.04,18.8 | v83.82,18.8 SJ10.3
GND  (via drill 0.6)
  Top 0.254: v71.12,5.59 v71.12,1.52
  Bottom 0.254: U1.P$1 69.85,6.86 v71.12,5.59 | v71.12,1.52 70.61,1.78
  pour Top: 0,0 137.16,0 137.16,27.94 0,27.94
  pour Bottom: 0,0 137.16,0 137.16,27.94 0,27.94
KEYCOL1  (via drill 0.6)
  Top 0.254: v124.71,18.29 125.98,19.56 130.81,19.56 132.33,18.03 U$14.3
  Bottom 0.254: v124.71,18.29 124.59,18.29 123.83,19.05 D2.1
KEYCOL2  (via drill 0.6)
  Top 0.254: v124.71,16.26 125.73,17.78 125.73,18.03 126.75,19.05 128.27,19.05 U$14.5
  Bottom 0.254: v124.71,16.26 123.83,17.14 D3.1
KEYCOL3  (via drill 0.6)
  Top 0.254: v124.46,13.97 127.25,17.27 U$14.7
  Bottom 0.254: v124.46,13.97 123.83,14.6 D4.1
MISO  (via drill 0.6)
  Top 0.254: v16.26,17.78 16.76,18.29 36.58,18.29 37.59,17.27 J1.1
  Bottom 0.254: U$1.16 13.62,18.29 16.26,18.29 v16.26,17.78
MOSI  (via drill 0.6)
  Top 0.254: v18.54,13.72 29.72,13.72 32,11.43 34.54,11.43 35.05,11.94 J1.4
  Bottom 0.254: U$1.15 12.95,18.42 12.95,19.05 13.21,19.3 17.02,19.3 18.54,17.78 v18.54,13.72
N$1
  Bottom 0.254: U$1.7 6.47,16 4.83,16 2.54,13.72 Y1.2 2.54,12.45 2.03,11.94 2.03,10.68 C4.2
N$2
  Bottom 0.254: U$1.8 5.49,17.78 Y1.1 2.56,17.8 C5.2
N$3
  Bottom 0.254: R4.2 U$14.2
N$4
  Bottom 0.254: R5.2 U$14.4
N$5
  Bottom 0.254: R6.2 U$14.6
N$6
  Bottom 0.254: R7.2 U$14.8
N$8
  Top 0.254: R10.1 R9.1 R8.1 74.41,25.54 D1.1
RESET  (via drill 0.6)
  Top 0.254: v10.41,12.19 12.19,13.97 17.02,13.97 17.78,14.73 28.19,14.73 28.45,14.48 31.24,14.48 32.26,15.49 J1.5
  Bottom 0.254: U$1.29 10.41,9.7 v10.41,12.19 | J1.5 31.35,14.34 R1.1
ROW0  (via drill 0.6)
  Top 0.254: v74.68,22.61 75.69,23.62 R8.2
  Bottom 0.254: SJ3.2 93.98,8.38 93.73,8.13 83.31,8.13 83.06,8.38 83.06,9.91 81.53,11.43 80.14,11.43 U1.P$25 79.88,11.68 77.98,11.68 76.71,12.95 76.71,19.81 76.2,20.32 75.69,20.32 74.68,21.34 v74.68,22.61
ROW1  (via drill 0.6)
  Top 0.254: v76.2,21.59 76.45,21.84 76.45,22.61 77.22,23.37 R9.2
  Bottom 0.254: SJ4.2 86.11,10.67 85.6,11.18 83.31,11.18 82.55,11.94 82.55,12.19 82.04,12.7 80.14,12.7 U1.P$24 79.88,12.7 78.49,12.7 77.47,13.72 77.47,20.32 v76.2,21.59
ROW2  (via drill 0.6)
  Top 0.254: v77.72,21.84 78.99,23.11 R10.2
  Bottom 0.254: SJ5.2 93.98,11.94 93.73,11.68 83.57,11.68 83.06,12.19 83.06,13.21 82.04,14.22 80.14,14.22 U1.P$23 79.88,13.97 78.99,13.97 78.23,14.73 78.23,21.34 v77.72,21.84
ROW3  (via drill 0.6)
  Top 0.254: v115.32,17.27 114.81,17.78 110.49,17.78 108.97,16.26 106.93,16.26 106.17,17.02 104.9,17.02 103.38,15.49 101.6,15.49 101.09,14.99 100.33,14.99 100.08,15.24 99.57,15.24 98.3,13.97 95.25,13.97 94.74,14.48 92.2,14.48 91.95,14.73 v90.42,14.73 | v115.32,11.68 116.33,12.7 117.86,12.7 118.36,13.21 119.63,13.21 120.4,12.45 121.41,12.45 121.92,11.94 124.21,11.94 124.46,12.19 127.51,12.19 128.02,12.7 129.03,12.7 129.79,11.94 132.84,11.94 133.35,11.43 v133.6,11.43
  Bottom 0.254: U1.P$22 80.14,15.24 82.04,15.24 83.06,14.22 85.6,14.22 | 85.6,14.22 86.11,13.72 SJ6.2 | v115.32,17.27 v115.32,11.68 | v133.6,11.43 133.72,11.54 R4.1 | 85.6,14.22 87.88,14.22 88.9,15.24 89.66,15.24 90.17,14.73 v90.42,14.73
ROW4  (via drill 0.6)
  Top 0.254: v119.13,11.68 119.38,11.43 120.4,11.43 120.9,10.92 124.71,10.92 124.97,11.18 126.49,11.18 127,10.67 130.81,10.67 v131.06,10.92 | v118.87,18.29 118.36,18.8 102.87,18.8 102.62,18.54 100.84,18.54 100.58,18.8 98.04,18.8 97.28,18.03 v96.77,18.03
  Bottom 0.254: v131.06,10.92 131.68,11.54 R5.1 | v119.13,11.68 118.87,11.94 v118.87,18.29 | v96.77,18.03 96.52,18.03 95.76,17.27 94.49,17.27 93.98,16.76 SJ7.2 93.98,16.51 93.73,16.76 93.47,16.76 92.96,17.27 89.41,17.27 89.15,17.02 89.15,16.26 87.63,14.73 83.31,14.73 82.3,15.75 81.79,15.75 81.53,16 81.53,16.26 81.28,16.51 80.14,16.51 U1.P$21
ROW5  (via drill 0.6)
  Top 0.254: v116.84,17.78 116.59,18.29 109.98,18.29 108.46,16.76 107.44,16.76 106.68,17.53 99.82,17.53 99.57,17.27 99.57,17.02 99.31,16.76 98.04,16.76 97.79,17.02 95.25,17.02 94.23,18.03 90.17,18.03 89.15,17.02 89.15,16.26 88.65,15.75 87.88,15.75 86.61,17.02 84.58,17.02 84.33,16.76 v84.07,16.76 | v116.84,11.68 117.86,11.68 118.11,11.94 118.11,12.19 118.62,12.7 119.38,12.7 120.14,11.94 120.9,11.94 121.41,11.43 124.46,11.43 124.71,11.68 126.75,11.68 127.25,11.18 128.27,11.18 128.52,11.43 v128.52,11.68
  Bottom 0.254: U1.P$20 80.14,17.78 82.55,17.78 83.06,17.27 83.31,17.27 83.82,16.76 v84.07,16.76 85.85,16.76 86.11,16.51 SJ8.2 | v116.84,17.78 v116.84,11.68 | v128.52,11.68 128.67,11.54 R6.1
ROW6  (via drill 0.6)
  Top 0.254: v119.89,10.41 124.97,10.41 125.22,10.67 126.24,10.67 v127.25,9.65 | v119.89,19.3 102.62,19.3 102.36,19.05 101.09,19.05 100.58,19.56 v97.03,19.56
  Bottom 0.254: U1.P$19 80.14,19.05 82.3,19.05 82.8,18.54 82.8,18.29 83.31,17.78 93.73,17.78 93.98,18.03 | 93.98,18.03 SJ9.2 | 93.98,18.03 94.23,17.78 95.5,17.78 95.76,18.03 95.76,19.05 96.27,19.56 v97.03,19.56 | v127.25,9.65 R7.1 | v119.89,10.41 119.89,10.92 120.14,11.18 120.14,12.19 119.38,12.95 119.38,17.27 119.89,17.78 v119.89,19.3
ROW7
  Bottom 0.254: U1.P$18 80.14,20.32 81.28,20.32 81.79,19.81 85.85,19.81 86.11,19.56 SJ10.2
ROW15  (via drill 0.6)
  Top 0.254: v71.88,14.73 71.88,14.48 58.17,14.48 57.15,13.46 43.69,13.46 40.89,10.67 31.24,10.67 29.97,11.94 28.19,11.94 26.67,10.41 17.02,10.41 16.51,10.92 9.4,10.92 8.89,11.43 v8.89,11.68
  Bottom 0.254: U1.P$10 69.98,19.05 71.63,19.05 71.88,18.8 v71.88,14.73 | U$1.32 8.13,9.81 8.13,10.41 8.89,11.18 v8.89,11.68
SCK  (via drill 0.6)
  Top 0.254: J1.3 35.05,16 34.04,17.02 32.26,17.02 31.5,17.78 29.72,17.78 29.21,17.27 28.96,17.27 28.45,16.76 v17.27,16.76
  Bottom 0.254: U$1.17 v17.27,16.76
SCL  (via drill 0.6)
  Top 0.254: v15.49,8.38 15.75,8.64 16.26,8.64 16.51,8.89 24.64,8.89 25.4,8.13 30.73,8.13 31.61,7.25 | 31.61,7.25 R2.1 33.16,7.11 34.54,7.11 35.31,6.35 JP6.2 | 31.61,7.25 31.75,7.11 31.75,5.08 32.77,4.06 43.94,4.06 45.72,2.29 50.29,2.29 51.05,1.52 52.83,1.52 53.34,1.02 54.86,1.02 55.37,1.52 66.04,1.52 66.55,1.02 70.1,1.02 70.61,0.51 71.88,0.51 76.71,5.33 v76.71,5.59 78.74,5.59 83.82,0.51 93.47,0.51 94.49,1.52 118.87,1.52 119.38,2.03 119.38,7.62 119.89,8.13 131.83,8.13 132.08,8.38 JP7.2
  Bottom 0.254: U$1.28 11.18,9.66 11.18,8.64 11.68,8.13 14.99,8.13 15.24,8.38 v15.49,8.38 | v76.71,5.59 76.71,9.4 77.6,10.29 U1.P$26
SDA  (via drill 0.6)
  Top 0.254: v14.73,9.65 15.75,9.65 16,9.4 24.89,9.4 25.65,8.64 37.34,8.64 38.35,7.62 JP6.1 39,7 R3.1 41.9,8.64 69.34,8.64 70.87,7.11 75.69,7.11 76.71,8.13 v77.72,8.13 118.62,8.13 119.13,8.64 130.05,8.64 131.83,10.41 134.11,10.41 135.89,8.64 JP7.1
  Bottom 0.254: U$1.27 11.94,9.62 11.94,8.89 12.19,8.64 14.22,8.64 14.73,9.14 v14.73,9.65 | v77.72,8.13 78.36,9.02 U1.P$27
SEGA  (via drill 0.6)
  Top 0.254: DIS8.7 v13.97,24.89 | v26.67,24.89 DIS7.7 | v52.07,24.89 DIS6.7 | v64.77,24.89 DIS5.7 | v90.17,24.89 DIS4.7 | v102.87,24.89 DIS3.7 | v115.57,24.89 DIS2.7 | 27.69,9.4 v27.43,9.65 27.94,9.65 28.45,9.14 53.85,9.14 v54.36,9.65 | v96.01,10.67 96.52,10.16 103.63,10.16 v104.14,10.67
  Bottom 0.254: v13.97,24.89 14.48,24.38 20.07,24.38 20.32,24.64 20.32,25.15 20.83,25.65 22.35,25.65 23.62,24.38 26.42,24.38 26.67,24.64 v26.67,24.89 27.18,24.38 45.47,24.38 46.48,25.4 47.75,25.4 48.77,24.38 51.56,24.38 v52.07,24.89 52.58,24.38 58.42,24.38 58.67,24.64 58.67,24.89 59.18,25.4 60.2,25.4 61.21,24.38 64.52,24.38 64.77,24.64 v64.77,24.89 65.02,24.64 66.29,24.64 67.82,26.16 82.3,26.16 83.57,24.89 83.82,24.89 84.33,25.4 85.85,25.4 86.87,24.38 89.66,24.38 v90.17,24.89 90.68,24.38 95.76,24.38 97.03,25.65 98.3,25.65 99.57,24.38 102.62,24.38 102.87,24.64 v102.87,24.89 103.38,24.38 108.97,24.38 109.98,25.4 111.25,25.4 112.27,24.38 115.06,24.38 v115.57,24.89 116.08,24.38 122.17,24.38 123.19,23.37 127.76,23.37 128.27,22.86 DIS1.7 | SJ19.3 v54.36,9.65 | v27.43,9.65 26.67,10.41 DIS7.7 | SJ3.1 95.76,10.54 v96.01,10.67 | v104.14,10.67 104.14,18.8 102.87,20.07 DIS3.7
SEGB  (via drill 0.6)
  Top 0.254: DIS8.6 v16.51,25.65 | v29.21,25.4 DIS7.6 | v54.61,25.4 DIS6.6 | v66.04,25.91 67.31,24.64 DIS5.6 | v92.71,25.4 DIS4.6 | v105.41,25.4 DIS3.6 | v118.11,25.4 DIS2.6 | v29.46,10.67 29.46,10.41 29.97,9.91 53.09,9.91 53.85,10.67 59.18,10.67 59.44,10.41 v61.72,10.41 | v88.14,10.16 88.65,9.91 90.42,9.91 91.19,10.67 92.71,10.67 93.73,9.65 111.51,9.65 112.52,10.67 115.57,10.67 115.82,10.41 118.11,10.41 118.36,10.16 v118.36,10.41
  Bottom 0.254: v16.51,25.65 17.02,25.15 19.56,25.15 20.57,26.16 22.61,26.16 23.62,25.15 25.4,25.15 26.16,25.91 27.18,25.91 28.19,24.89 28.96,24.89 29.21,25.15 v29.21,25.4 29.72,24.89 44.96,24.89 45.97,25.91 48.26,25.91 49.28,24.89 50.55,24.89 51.56,25.91 52.83,25.91 53.34,25.4 v54.61,25.4 55.12,24.89 57.66,24.89 58.67,25.91 60.71,25.91 61.72,24.89 63.25,24.89 64.26,25.91 v66.04,25.91 66.8,26.67 82.8,26.67 83.57,25.91 86.61,25.91 87.38,25.15 89.15,25.15 89.92,25.91 90.68,25.91 91.69,24.89 92.46,24.89 92.71,25.15 v92.71,25.4 93.22,24.89 95.5,24.89 96.77,26.16 98.55,26.16 99.82,24.89 101.6,24.89 102.62,25.91 103.63,25.91 104.14,25.4 v105.41,25.4 105.92,24.89 108.71,24.89 109.73,25.91 111.51,25.91 112.52,24.89 113.79,24.89 114.81,25.91 116.33,25.91 116.84,25.4 v118.11,25.4 118.62,24.89 122.68,24.89 123.7,23.88 128.27,23.88 130.56,21.59 DIS1.6 | SJ20.3 62.74,9.53 62.74,9.91 62.23,10.41 v61.72,10.41 | v29.46,10.67 29.21,10.92 DIS7.6 | SJ4.1 87.76,10.41 v88.14,10.16 | 118.11,10.67 v118.36,10.41 118.36,10.92 118.11,11.18 118.11,12.19 118.36,12.45 118.36,16.76 117.86,17.27 117.86,18.8 118.11,19.05 DIS2.6
SEGC  (via drill 0.6)
  Top 0.254: v54.36,12.45 v52.07,12.45 | DIS8.4 v13.97,3.05 | v26.67,3.05 DIS7.4 | v52.07,2.54 DIS6.4 | v64.77,2.54 DIS5.4 | v90.17,2.03 DIS4.4 | v102.87,3.05 DIS3.4 | v115.57,3.05 DIS2.4 | 102.62,16.26 v102.87,16.51 102.36,17.02 100.33,17.02 99.57,16.26 99.06,16.26 97.79,14.99 96.52,14.99 v96.01,15.49
  Bottom 0.254: SJ21.3 v54.36,12.45 | v52.07,12.45 DIS6.4 | v102.87,16.51 DIS3.4 | v13.97,3.05 14.48,3.56 19.81,3.56 20.83,2.54 22.35,2.54 23.37,3.56 26.42,3.56 26.67,3.3 v26.67,3.05 27.18,3.56 45.21,3.56 46.23,2.54 48.01,2.54 48.51,3.05 51.82,3.05 52.07,2.79 v52.07,2.54 52.58,3.05 54.61,3.05 55.63,2.03 60.45,2.03 61.47,3.05 64.52,3.05 64.77,2.79 v64.77,2.54 65.28,3.05 79.76,3.05 80.77,2.03 84.33,2.03 84.58,1.78 85.85,1.78 86.11,1.52 88.65,1.52 89.66,2.54 89.92,2.54 v90.17,2.03 90.68,2.54 93.47,2.54 94.49,1.52 98.3,1.52 100.33,3.56 102.62,3.56 102.87,3.3 v102.87,3.05 103.38,3.56 105.92,3.56 106.93,2.54 111.25,2.54 112.27,3.56 115.06,3.56 v115.57,3.05 116.08,3.56 121.92,3.56 122.94,4.57 127.76,4.57 128.27,5.08 DIS1.4 | SJ5.1 96.01,13.84 v96.01,15.49
SEGD  (via drill 0.6)
  Top 0.254: v46.99,12.19 50.8,12.19 51.56,11.43 59.18,11.43 59.69,11.94 60.45,11.94 60.96,12.45 v61.47,12.45 64.52,12.45 65.53,13.46 66.8,13.46 67.06,13.21 78.74,13.21 80.77,15.24 86.61,15.24 87.12,14.73 88.39,14.73 88.9,14.22 v89.15,14.22 | DIS8.2 v8.89,3.56 | v21.59,3.56 DIS7.2 | v47.24,3.56 46.99,3.81 DIS6.2 | v59.69,3.05 DIS5.2 | v85.09,2.79 DIS4.2 | v97.79,2.54 DIS3.2 | v110.49,3.56 DIS2.2
  Bottom 0.254: SJ22.3 v61.47,12.45 | v46.99,12.19 DIS6.2 | v8.89,3.56 9.4,4.06 21.34,4.06 21.59,3.81 v21.59,3.56 22.1,4.06 46.74,4.06 v47.24,3.56 47.75,4.06 49.53,4.06 50.04,3.56 54.86,3.56 55.88,2.54 58.17,2.54 58.67,3.05 v59.69,3.05 60.2,3.56 80.26,3.56 81.28,2.54 84.58,2.54 84.84,2.79 v85.09,2.79 85.34,2.54 86.11,2.54 86.61,2.03 88.39,2.03 89.41,3.05 93.73,3.05 94.74,2.03 96.01,2.03 96.52,2.54 v97.79,2.54 98.3,3.05 99.06,3.05 100.08,4.06 106.17,4.06 107.19,3.05 108.71,3.05 109.22,3.56 v110.49,3.56 111,4.06 121.67,4.06 123.19,5.59 DIS1.2 | SJ6.1 88.01,13.72 88.39,13.72 88.9,14.22 v89.15,14.22
SEGE  (via drill 0.6)
  Top 0.254: v54.36,14.73 54.1,15.24 50.55,15.24 50.04,14.73 45.72,14.73 44.96,15.49 v44.45,15.49 | v57.15,3.56 DIS5.1 | v82.55,3.56 DIS4.1 | v95.25,3.05 DIS3.1 | v107.95,4.06 DIS2.1 | v98.81,17.78 99.31,18.29 100.33,18.29 100.58,18.03 102.87,18.03 103.12,18.29 107.44,18.29 v107.95,17.78
  Bottom 0.254: SJ23.3 54.61,14.86 v54.36,14.73 | v44.45,15.49 DIS6.1 44.45,5.08 43.94,4.57 | v107.95,17.78 DIS2.1 | DIS8.1 6.35,5.08 6.86,4.57 18.54,4.57 | 18.54,4.57 19.05,5.08 DIS7.1 | 18.54,4.57 43.94,4.57 | 43.94,4.57 49.78,4.57 50.29,4.06 56.9,4.06 57.15,3.81 v57.15,3.56 57.66,4.06 82.3,4.06 82.55,3.81 v82.55,3.56 82.8,3.81 85.85,3.81 87.12,2.54 88.14,2.54 89.15,3.56 94.49,3.56 95,3.05 v95.25,3.05 95.76,3.56 98.81,3.56 99.82,4.57 107.44,4.57 v107.95,4.06 108.46,4.57 120.14,4.57 120.65,5.08 DIS1.1 | SJ7.1 95.89,16.76 96.77,16.76 97.03,17.02 97.54,17.02 98.3,17.78 v98.81,17.78
SEGF  (via drill 0.6)
  Top 0.254: DIS8.9 v8.89,24.64 | v21.59,24.64 DIS7.9 | v46.99,24.38 DIS6.9 | v59.69,24.38 DIS5.9 | v85.09,24.38 DIS4.9 | v97.79,24.64 DIS3.9 | v110.49,24.38 DIS2.9 | v61.72,16.76 61.72,16.26 50.8,16.26 50.29,16.76 49.02,16.76 48.01,15.75 v46.99,15.75 | v88.14,16.76 90.17,18.8 91.19,18.8 91.44,18.54 92.46,18.54 93.73,19.81 96.01,19.81 DIS3.9 | 97.79,20.83 DIS3.9
  Bottom 0.254: v8.89,24.64 9.65,23.88 20.83,23.88 v21.59,24.64 22.35,23.88 46.48,23.88 v46.99,24.38 47.5,23.88 59.44,23.88 59.69,24.13 v59.69,24.38 60.2,23.88 66.8,23.88 67.31,24.38 67.31,24.64 68.33,25.65 81.79,25.65 83.57,23.88 84.84,23.88 85.09,24.13 v85.09,24.38 85.6,23.88 97.03,23.88 v97.79,24.64 98.55,23.88 109.98,23.88 v110.49,24.38 111,23.88 121.67,23.88 123.19,22.35 DIS1.9 | SJ24.3 62.1,16.51 v61.72,16.76 | v46.99,15.75 DIS6.9 | SJ8.1 v88.14,16.76
SEGG
  Bottom 0.254: DIS8.10 8.13,23.37 18.29,23.37 | 18.29,23.37 19.05,22.61 DIS7.10 | 18.29,23.37 43.69,23.37 | 43.69,23.37 44.45,22.61 DIS6.10 | 43.69,23.37 56.64,23.37 | 56.64,23.37 57.15,22.86 DIS5.10 57.15,21.34 55.37,19.56 55.37,18.92 SJ25.3 | 56.64,23.37 67.31,23.37 68.07,24.13 68.07,24.64 68.58,25.15 81.53,25.15 82.55,24.13 82.55,22.86 | 82.55,22.86 DIS4.10 | 82.55,22.86 83.06,23.37 94.74,23.37 | 94.74,23.37 95.25,22.86 DIS3.10 95.25,19.18 SJ9.1 | 94.74,23.37 107.19,23.37 | 107.19,23.37 107.95,22.61 DIS2.10 | 107.19,23.37 120.14,23.37 120.65,22.86 DIS1.10
SEGP  (via drill 0.6)
  Top 0.254: v53.09,17.78 v59.94,17.78 66.8,17.78 67.31,18.29 82.8,18.29 83.31,17.78 84.33,17.78 85.34,18.8 v88.65,18.8 | DIS8.5 v16.51,2.54 | v29.21,2.54 DIS7.5 | v54.1,2.03 54.61,2.54 DIS6.5 | v67.31,2.03 DIS5.5 | v92.71,1.52 DIS4.5 | v105.41,2.54 DIS3.5 | v118.11,2.54 DIS2.5
  Bottom 0.254: SJ26.3 61.21,18.8 60.2,17.78 v59.94,17.78 | v53.09,17.78 53.09,8.89 54.61,7.37 DIS6.5 | v88.65,18.8 SJ10.1 | DIS1.5 130.81,5.33 129.54,4.06 123.7,4.06 122.68,3.05 118.62,3.05 v118.11,2.54 118.11,2.29 117.6,2.03 105.92,2.03 v105.41,2.54 104.9,2.03 99.57,2.03 98.55,1.02 94.23,1.02 93.73,1.52 v92.71,1.52 92.2,1.52 91.69,1.02 85.85,1.02 85.6,1.27 84.33,1.27 84.07,1.52 80.52,1.52 79.5,2.54 67.82,2.54 v67.31,2.03 67.31,2.29 67.06,2.54 66.8,2.54 65.79,1.52 64.01,1.52 63.25,2.29 61.72,2.29 60.96,1.52 54.61,1.52 v54.1,2.03 53.59,2.03 53.09,1.52 51.05,1.52 50.55,2.03 45.97,2.03 44.96,3.05 29.72,3.05 v29.21,2.54 28.45,2.54 27.94,2.03 20.07,2.03 19.56,2.54 v16.51,2.54
UC_RX
  Bottom 0.254: U$1.30 9.65,9.62 9.65,8.64 9.14,8.13 5.33,8.13 4.45,7.24 JP1.1
UC_TX
  Bottom 0.254: U$1.31 8.89,9.58 8.89,8.89 8.64,8.64 3.05,8.64 1.65,7.24 JP1.2

### Text on the board
tPlace: +5V | A0 | 1 | 2 | GND | COL3 | 2 | 1 | GND | +5V | GND | ROW4 | 3 | 2 | 1 | SDA | TX | RX | SCL | SCL | SDA | Marty McFly v1 09/2015 | Evan Green | For Caitlin
bPlace: CC<>CA | CC<>CA